# Altium schematic sheet eMMC.SchDoc: eMMC
size A4; Date: Not used; ApprovedBy: Not used; CheckedBy: Not used; Author: Not used; CompanyName: STMicroelectronics; DrawnBy: Not used; Engineer: Not used; Organization: Not used; Address1: Not used; Address2: Not used; Address3: Not used; Address4: Not used; DocumentNumber: Not used; Revision: Not used; SheetNumber: 8; SheetTotal: 16; CurrentTime: Not used; CurrentDate: Not used; Time: Not used; DocumentFullPathAndName: Not used; DocumentName: Not used; ModifiedDate: Not used; ImagePath: Not used; ProjectName: Not used; Application_BuildNumber: Not used
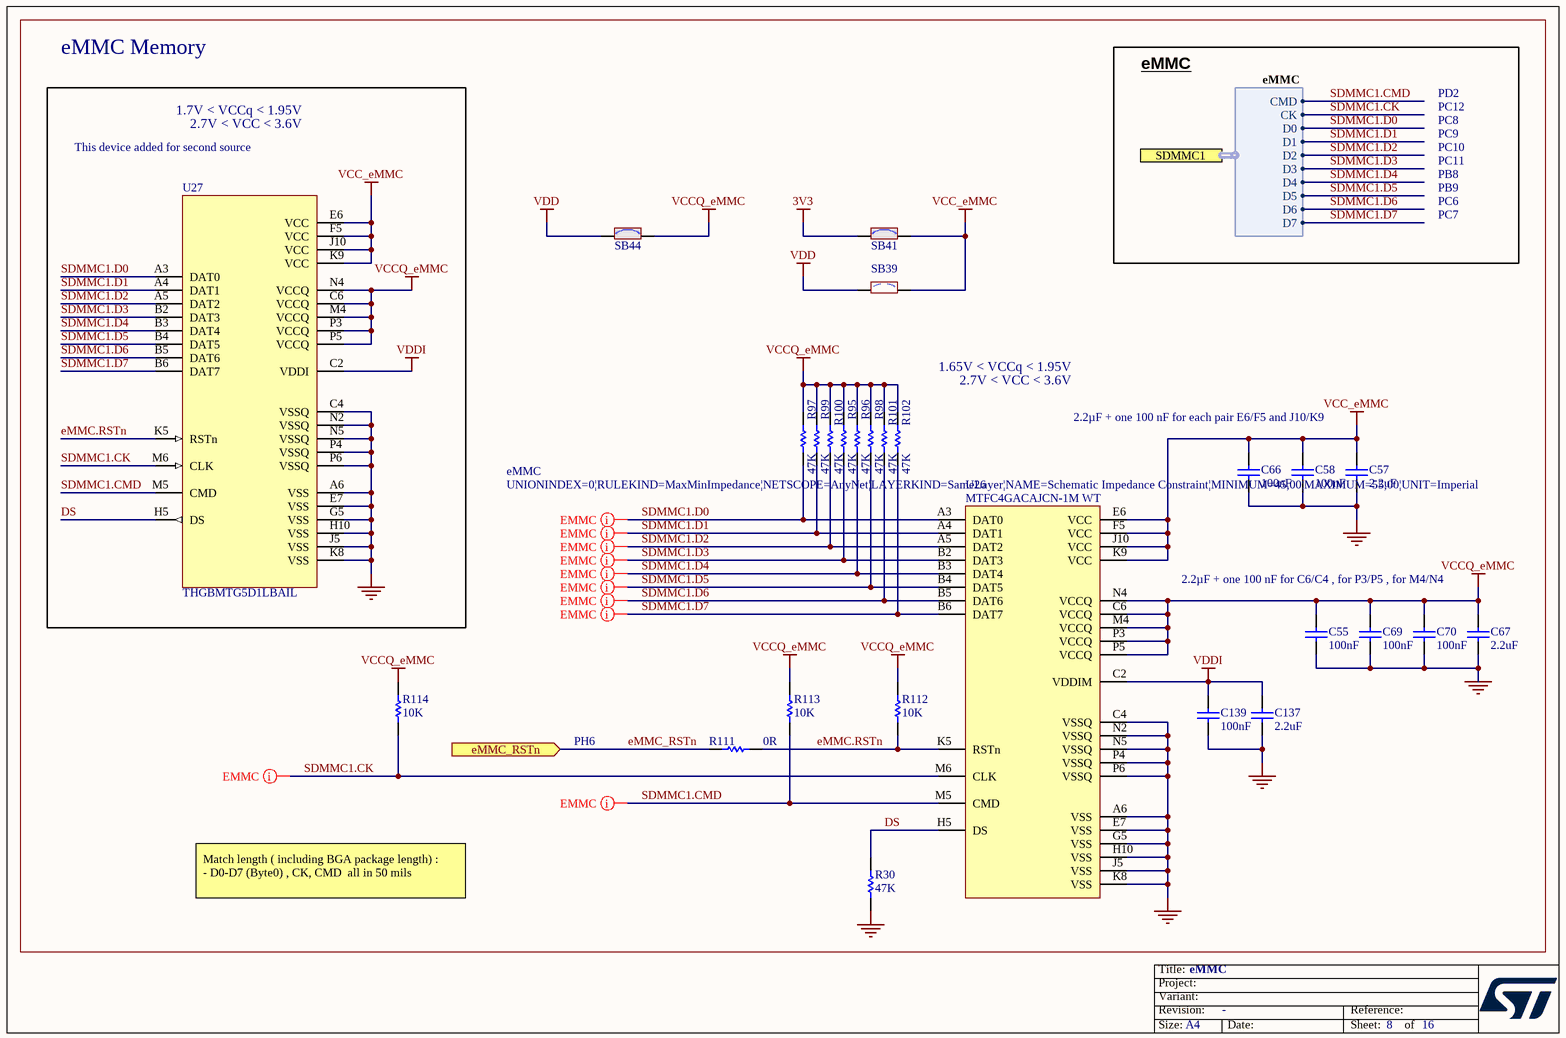
[diagram p0: eMMC.SchDoc]

## Parts
C55  value 100nF  [C0402]  (hidden comment: Capacitor)
C57  value 2.2uF  [C0603]  (hidden comment: Capacitor)
C58  value 100nF  [C0402]  (hidden comment: Capacitor)
C66  value 100nF  [C0402]  (hidden comment: Capacitor)
C67  value 2.2uF  [C0603]  (hidden comment: Capacitor)
C69  value 100nF  [C0402]  (hidden comment: Capacitor)
C70  value 100nF  [C0402]  (hidden comment: Capacitor)
C137  value 2.2uF  [C0603]  (hidden comment: Capacitor)
C139  value 100nF  [C0402]  (hidden comment: Capacitor)
R30  value 47K  [R0402]  (hidden comment: Resistor)
R95  value 47K  [R0402]  (hidden comment: Resistor)
R96  value 47K  [R0402]  (hidden comment: Resistor)
R97  value 47K  [R0402]  (hidden comment: Resistor)
R98  value 47K  [R0402]  (hidden comment: Resistor)
R99  value 47K  [R0402]  (hidden comment: Resistor)
R100  value 47K  [R0402]  (hidden comment: Resistor)
R101  value 47K  [R0402]  (hidden comment: Resistor)
R102  value 47K  [R0402]  (hidden comment: Resistor)
R111  value 0R  [R0402]  (hidden comment: Resistor)
R112  value 10K  [R0402]  (hidden comment: Resistor)
R113  value 10K  [R0402]  (hidden comment: Resistor)
R114  value 10K  [R0402]  (hidden comment: Resistor)
SB39  SB_OFF  [SOLDER-BRIDGE_R0402-0R]  (value not drawn)
SB41  SB_ON  [SOLDER-BRIDGE_R0402-0R]  (value not drawn)
SB44  SB_ON  [SOLDER-BRIDGE_R0402-0R]  (value not drawn)
U26  MTFC4GACAJCN-1M WT  [ICC_P-WFBGA153_13X11P5_P050]
U27  value THGBMTG5D1LBAIL  [ICC_P-WFBGA153_13X11P5_P050]  (hidden comment: eMMC_THGBMTG5D1LBAIL)

## Ports
eMMC_RSTn (in), SDMMC1 (harness eMMC)

## Harnesses
eMMC: D0, CMD, CK, D1, D2, D3, D4, D5, D6, D7

## Nets
3V3: SB41.1
GND: C55.1 C57.1 C58.1 C66.1 C67.1 C69.1 C70.1 C137.1 C139.1 R30.1 U26.A6(VSS) U26.C4(VSSQ) U26.E7(VSS) U26.G5(VSS) U26.H10(VSS) U26.J5(VSS) U26.K8(VSS) U26.N2(VSSQ) U26.N5(VSSQ) U26.P4(VSSQ) U26.P6(VSSQ) U27.A6(VSS) U27.C4(VSSQ) U27.E7(VSS) U27.G5(VSS) U27.H10(VSS) U27.J5(VSS) U27.K8(VSS) U27.N2(VSSQ) U27.N5(VSSQ) U27.P4(VSSQ) U27.P6(VSSQ)
VCC_eMMC: C57.2 C58.2 C66.2 SB39.2 SB41.2 U26.E6(VCC) U26.F5(VCC) U26.J10(VCC) U26.K9(VCC) U27.E6(VCC) U27.F5(VCC) U27.J10(VCC) U27.K9(VCC)
VCCQ_eMMC: C55.2 C67.2 C69.2 C70.2 R95.2 R96.2 R97.2 R98.2 R99.2 R100.2 R101.2 R102.2 R112.2 R113.2 R114.2 SB44.2 U26.C6(VCCQ) U26.M4(VCCQ) U26.N4(VCCQ) U26.P3(VCCQ) U26.P5(VCCQ) U27.C6(VCCQ) U27.M4(VCCQ) U27.N4(VCCQ) U27.P3(VCCQ) U27.P5(VCCQ)
VDD: SB39.1 SB44.1
VDDI: C137.2 C139.2 U26.C2(VDDIM) U27.C2(VDDI)
DS: R30.2 U26.H5(DS) U27.H5(DS)
eMMC.RSTn: R111.2 R112.1 U26.K5(RSTn) U27.K5(RSTn)
eMMC_RSTn: R111.1 ; port eMMC_RSTn
SDMMC1.CK: R114.1 U26.M6(CLK) U27.M6(CLK) ; port SDMMC1.CK
SDMMC1.CMD: R113.1 U26.M5(CMD) U27.M5(CMD) ; port SDMMC1.CMD
SDMMC1.D0: R97.1 U26.A3(DAT0) U27.A3(DAT0) ; port SDMMC1.D0
SDMMC1.D1: R99.1 U26.A4(DAT1) U27.A4(DAT1) ; port SDMMC1.D1
SDMMC1.D2: R100.1 U26.A5(DAT2) U27.A5(DAT2) ; port SDMMC1.D2
SDMMC1.D3: R95.1 U26.B2(DAT3) U27.B2(DAT3) ; port SDMMC1.D3
SDMMC1.D4: R96.1 U26.B3(DAT4) U27.B3(DAT4) ; port SDMMC1.D4
SDMMC1.D5: R98.1 U26.B4(DAT5) U27.B4(DAT5) ; port SDMMC1.D5
SDMMC1.D6: R101.1 U26.B5(DAT6) U27.B5(DAT6) ; port SDMMC1.D6
SDMMC1.D7: R102.1 U26.B6(DAT7) U27.B6(DAT7) ; port SDMMC1.D7

## Layout directives
rule Matched Net Lengths [Tolerance = 20mil]; rule Impedance Constraint [Min = 45.00    Max = 55.00    ]; net class eMMC: SDMMC1.D0
rule Matched Net Lengths [Tolerance = 20mil]; rule Impedance Constraint [Min = 45.00    Max = 55.00    ]: SDMMC1.CK, SDMMC1.D1, SDMMC1.D2, SDMMC1.D3, SDMMC1.D4, SDMMC1.D5, SDMMC1.D6, SDMMC1.D7
rule Matched Net Lengths [Tolerance = 50mil]; rule Impedance Constraint [Min = 45.00    Max = 55.00    ]: SDMMC1.CMD

## Notes on the sheet
- eMMC Memory
- 1.7V < VCCq < 1.95V
- 2.7V < VCC < 3.6V
- eMMC
- PC12
- PD2
- This device added for second source
- PC8
- PC9
- PC10
- PC11
- PB8
- PC6
- PC7
- PB9
- 1.65V < VCCq < 1.95V
- 2.2µF + one 100 nF for each pair E6/F5 and J10/K9
- 2.2µF + one 100 nF for C6/C4 , for P3/P5 , for M4/N4
- PH6
- Match length ( including BGA package length) :
  - D0-D7 (Byte0) , CK, CMD  all in 50 mils
- Title:
- Project:
- Size:
- Revision:
- Variant:
- A4
- -
- Date:
- Reference:
- Sheet:
- of

## Library data of the parts
C55 C58 C66 C69 C70 C139 = MCD-00006: Capacitor, MLCC, 100nF, 16V, X7R, +/-10%, 0402, T=0.5mm; Manufacturer_Part_Number: CC0402KRX7R7BB104; Manufacturer: YAGEO; Part_Preference: Recommended; Order_Code_RS: 616-9701; Component_Country_Of_Origin: China; Internal_Part_Number: MCD-00006; Status: Released; Part_Type: Capacitor; Package: 0402; ComponentLink1URL: http://tunmcdsvn.tun.st.com/Component_Documentation_Library/Trunk/Capacitor/YAGEO_X7R_Series; Order_Code_Digikey: 311-1338-1-ND; Order_Code_Farnell: 9402047
C57 C67 C137 = MCD-00012: Capacitor, MLCC, 2.2uF, 10V, X5R, +/- 10%, 0603, T=0.8mm; Manufacturer_Part_Number: CC0603KRX5R6BB225; Manufacturer: YAGEO; BMS_Part_Number: 9142010; Part_Preference: Recommended; Component_Country_Of_Origin: China; Internal_Part_Number: MCD-00012; Status: Released; Part_Type: Capacitor; Package: 0603; ComponentLink1URL: http://tunmcdsvn.tun.st.com/Component_Documentation_Library/Trunk/Capacitor/YAGEO_X5R_Series; Order_Code_Digikey: 311-1451-1-ND; Order_Code_Farnell: 2370679; Order_Code_RS: N/A
R30 R95-R102 = MCD-00063: Resistor, 47K, 0402, +/-1%, 1/16W; Manufacturer_Part_Number: RC0402FR-0747KL; Manufacturer: YAGEO; Part_Preference: Recommended; Component_Country_Of_Origin: China; Internal_Part_Number: MCD-00063; Status: Released; Part_Type: Resistor; Package: 0402; ComponentLink1URL: http://tunmcdsvn.tun.st.com/Component_Documentation_Library/Trunk/Resistor/YAGEO_RC_L_Series; Order_Code_Digikey: 311-47.0KLRCT-ND; Order_Code_Farnell: 9239430; Order_Code_RS: N/A
R111 = MCD-00052: Resistor, 0R, 0402, +/-5%, 1/16W; Manufacturer_Part_Number: RC0402JR-070RL; Manufacturer: YAGEO; Part_Preference: Recommended; Order_Code_RS: 618-5804; Component_Country_Of_Origin: China; Internal_Part_Number: MCD-00052; Status: Released; Part_Type: Resistor; Package: 0402; ComponentLink1URL: http://tunmcdsvn.tun.st.com/Component_Documentation_Library/Trunk/Resistor/YAGEO_RC_L_Series; Order_Code_Digikey: 311-0.0JRCT-ND; Order_Code_Farnell: 9232516RL
R112-R114 = MCD-00053: Resistor, 10K, 0402, +/-1%, 1/16W; Manufacturer_Part_Number: RC0402FR-0710KL; Manufacturer: YAGEO; BMS_Part_Number: 9131590; Part_Preference: Recommended; Component_Country_Of_Origin: China; Internal_Part_Number: MCD-00053; Status: Released; Part_Type: Resistor; Package: 0402; ComponentLink1URL: http://tunmcdsvn.tun.st.com/Component_Documentation_Library/Trunk/Resistor/YAGEO_RC_L_Series; Order_Code_Digikey: 311-10.0KLRCT-ND; Order_Code_Farnell: 9239359; Order_Code_RS: N/A
SB39 = MCD-02162: Solder Bridge 0402 OFF; Part_Type: Misc; Manufacturer_Part_Number: RC0402JR-070RL; Manufacturer: YAGEO; Part_Preference: Recommended; Order_Code_RS: 618-5804; Component_Country_Of_Origin: China; Internal_Part_Number: MCD-02162; Status: Checked; Package: SB0402; ComponentLink1URL: http://tunmcdsvn.tun.st.com/Component_Datasheet_Library/Trunk/Resistors/Yageo_Resistor_RC0402-series; Order_Code_Digikey: 311-0.0JRTR-ND; Order_Code_Farnell: 2363467
SB41 SB44 = MCD-01618: Solder Bridge 0402 ON; Part_Type: Misc; Manufacturer_Part_Number: RC0402JR-070RL; Manufacturer: YAGEO; Part_Preference: Recommended; Order_Code_RS: 618-5804; Component_Country_Of_Origin: China; Internal_Part_Number: MCD-01618; Status: Released; Package: SB0402; ComponentLink1URL: http://tunmcdsvn.tun.st.com/Component_Datasheet_Library/Trunk/Resistors/Yageo_Resistor_RC0402-series; Order_Code_Digikey: 311-0.0JRTR-ND; Order_Code_Farnell: 2363467
U26 = MCD-01137: 4G MultiMediaCard (MMC) controller and NAND Flash; Part_Type: IC; Manufacturer: MICRON; BMS_Part_Number: 9171977; Part_Preference: Recommended; Component_Country_Of_Origin: Singapore; Internal_Part_Number: MCD-01137; Value: MTFC4GACAJCN-1M WT; Status: Released; Manufacturer_Part_Number: MTFC4GACAJCN-1M WT; Package: FBGA153; ComponentLink1URL: http://tunmcdsvn.tun.st.com/Component_Datasheet_Library/Trunk/IC/MICRON_eMMC_MTFC4GACAJCN-1M WT
U27 = MCD-02799: Memory, eMMC, 4GB, 15nm ,WFBGA , 153 pins; Part_Type: IC; Part_Preference: Recommended; Manufacturer: KIOXIA; Component_Country_Of_Origin: Unknown; ShowFields: YES; ID: 4911; Internal_Part_Number: MCD-02799; Status: Checked; Manufacturer_Part_Number: THGBMTG5D1LBAIL; Package: WFBGA153; ComponentLink1URL: http://tunmcdsvn.tun.st.com/Component_Documentation_Library/Trunk/IC/KIOXIA_THGBMTG5D1LBAIL; Order_Code_Digikey: N/A; Order_Code_Farnell: N/A; Order_Code_RS: N/A